# Altium project STM_controller.PrjPcb
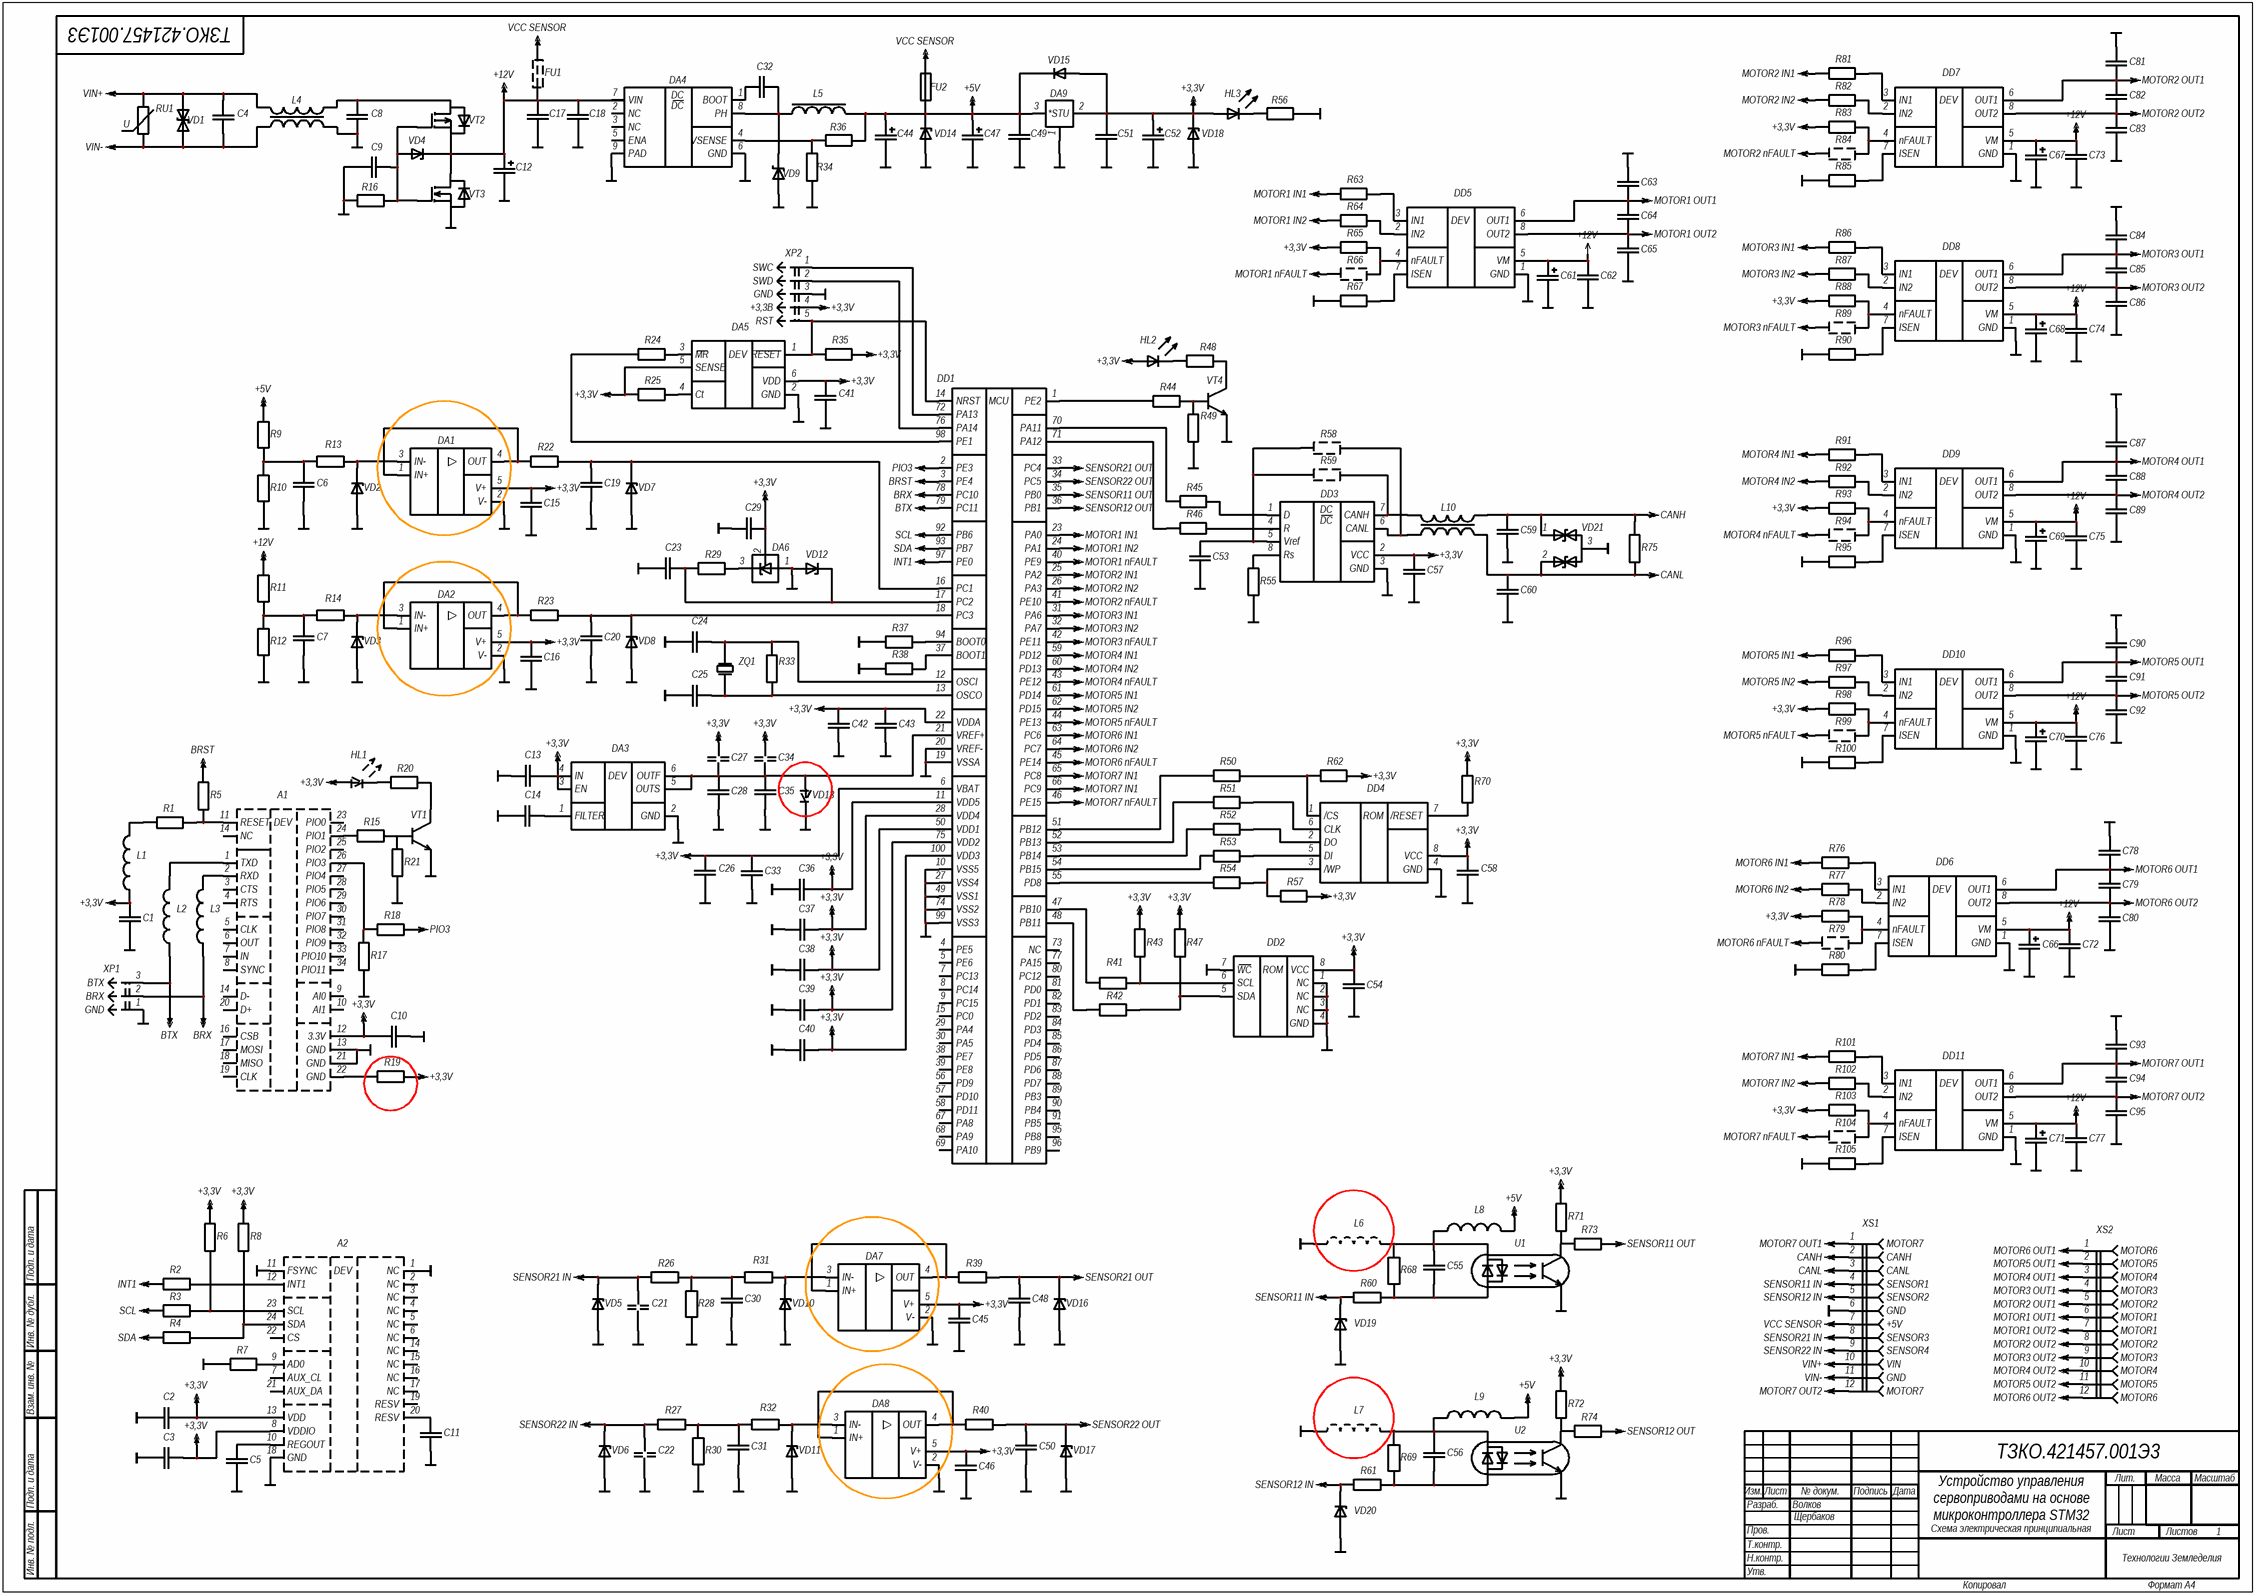
[diagram p0: Microcontroller.SchDoc]
1 sheet, 270 parts. Net scope: global (net labels, ports and power ports of the same name join across sheets).

## Sheet Microcontroller.SchDoc
size 840 x 594 mm; SheetNumber: 1; SheetTotal: 1; Разработчик: Волков; Количество_листов: 1; Организация: Технологии Земледелия; Номер_документа: ТЗКО.421457.001Э3; Название_документа: Устройство управления сервоприводами на основе микроконтроллера STM32

### Parts
A1  HC-06  (value not drawn)
A2  ICM-20948  (value not drawn)
C1  Capacitor_Fixed  (value not drawn)
C2  Capacitor_Fixed  (value not drawn)
C3  Capacitor_Fixed  (value not drawn)
C4  Capacitor_Fixed  (value not drawn)
C5  Capacitor_Fixed  (value not drawn)
C6  Capacitor_Fixed  (value not drawn)
C7  Capacitor_Fixed  (value not drawn)
C8  Capacitor_Fixed  (value not drawn)
C9  Capacitor_Fixed  (value not drawn)
C10  Capacitor_Fixed  (value not drawn)
C11  Capacitor_Fixed  (value not drawn)
C12  Capacitor_Polarized  (value not drawn)
C13  Capacitor_Fixed  (value not drawn)
C14  Capacitor_Fixed  (value not drawn)
C15  Capacitor_Fixed  (value not drawn)
C16  Capacitor_Fixed  (value not drawn)
C17  Capacitor_Fixed  (value not drawn)
C18  Capacitor_Fixed  (value not drawn)
C19  Capacitor_Fixed  (value not drawn)
C20  Capacitor_Fixed  (value not drawn)
C21  Capacitor_Fixed_Not_Installed  (value not drawn)
C22  Capacitor_Fixed_Not_Installed  (value not drawn)
C23  Capacitor_Fixed  (value not drawn)
C24  Capacitor_Fixed  (value not drawn)
C25  Capacitor_Fixed  (value not drawn)
C26  Capacitor_Fixed  (value not drawn)
C27  Capacitor_Fixed_Not_Installed  (value not drawn)
C28  Capacitor_Fixed  (value not drawn)
C29  Capacitor_Fixed  (value not drawn)
C30  Capacitor_Fixed  (value not drawn)
C31  Capacitor_Fixed  (value not drawn)
C32  Capacitor_Fixed  (value not drawn)
C33  Capacitor_Fixed  (value not drawn)
C34  Capacitor_Fixed_Not_Installed  (value not drawn)
C35  Capacitor_Fixed  (value not drawn)
C36  Capacitor_Fixed  (value not drawn)
C37  Capacitor_Fixed  (value not drawn)
C38  Capacitor_Fixed  (value not drawn)
C39  Capacitor_Fixed  (value not drawn)
C40  Capacitor_Fixed  (value not drawn)
C41  Capacitor_Fixed  (value not drawn)
C42  Capacitor_Fixed  (value not drawn)
C43  Capacitor_Fixed  (value not drawn)
C44  Capacitor_Polarized  (value not drawn)
C45  Capacitor_Fixed  (value not drawn)
C46  Capacitor_Fixed  (value not drawn)
C47  Capacitor_Polarized  (value not drawn)
C48  Capacitor_Fixed  (value not drawn)
C49  Capacitor_Fixed  (value not drawn)
C50  Capacitor_Fixed  (value not drawn)
C51  Capacitor_Fixed  (value not drawn)
C52  Capacitor_Polarized  (value not drawn)
C53  Capacitor_Fixed  (value not drawn)
C54  Capacitor_Fixed  (value not drawn)
C55  Capacitor_Fixed  (value not drawn)
C56  Capacitor_Fixed  (value not drawn)
C57  Capacitor_Fixed  (value not drawn)
C58  Capacitor_Fixed  (value not drawn)
C59  Capacitor_Fixed  (value not drawn)
C60  Capacitor_Fixed  (value not drawn)
C61  Capacitor_Polarized  (value not drawn)
C62  Capacitor_Fixed  (value not drawn)
C63  Capacitor_Fixed  (value not drawn)
C64  Capacitor_Fixed  (value not drawn)
C65  Capacitor_Fixed  (value not drawn)
C66  Capacitor_Polarized  (value not drawn)
C67  Capacitor_Polarized  (value not drawn)
C68  Capacitor_Polarized  (value not drawn)
C69  Capacitor_Polarized  (value not drawn)
C70  Capacitor_Polarized  (value not drawn)
C71  Capacitor_Polarized  (value not drawn)
C72  Capacitor_Fixed  (value not drawn)
C73  Capacitor_Fixed  (value not drawn)
C74  Capacitor_Fixed  (value not drawn)
C75  Capacitor_Fixed  (value not drawn)
C76  Capacitor_Fixed  (value not drawn)
C77  Capacitor_Fixed  (value not drawn)
C78  Capacitor_Fixed  (value not drawn)
C79  Capacitor_Fixed  (value not drawn)
C80  Capacitor_Fixed  (value not drawn)
C81  Capacitor_Fixed  (value not drawn)
C82  Capacitor_Fixed  (value not drawn)
C83  Capacitor_Fixed  (value not drawn)
C84  Capacitor_Fixed  (value not drawn)
C85  Capacitor_Fixed  (value not drawn)
C86  Capacitor_Fixed  (value not drawn)
C87  Capacitor_Fixed  (value not drawn)
C88  Capacitor_Fixed  (value not drawn)
C89  Capacitor_Fixed  (value not drawn)
C90  Capacitor_Fixed  (value not drawn)
C91  Capacitor_Fixed  (value not drawn)
C92  Capacitor_Fixed  (value not drawn)
C93  Capacitor_Fixed  (value not drawn)
C94  Capacitor_Fixed  (value not drawn)
C95  Capacitor_Fixed  (value not drawn)
DA1  OPA348AIDBVR  (value not drawn)
DA2  OPA348AIDBVR  (value not drawn)
DA3  MAX6070BAUT12+T  (value not drawn)
DA4  TPS5430DDAR  (value not drawn)
DA5  TPS3808G33DBVR  (value not drawn)
DA6  TL431  (value not drawn)
DA7  OPA348AIDBVR  (value not drawn)
DA8  OPA348AIDBVR  (value not drawn)
DA9  LM1117MP  (value not drawn)
DD1  STM32F103VET6  (value not drawn)
DD2  M24256E-FMN6TP  (value not drawn)
DD3  VP230  (value not drawn)
DD4  W25Q64JVSSIQ  (value not drawn)
DD5  AT8236  (value not drawn)
DD6  AT8236  (value not drawn)
DD7  AT8236  (value not drawn)
DD8  AT8236  (value not drawn)
DD9  AT8236  (value not drawn)
DD10  AT8236  (value not drawn)
DD11  AT8236  (value not drawn)
FU1  Fuse_Not_Inctalled  (value not drawn)
FU2  Fuse  (value not drawn)
HL1  Diode_Light_Emitting_Not_Installed  (value not drawn)
HL2  Diode_Light_Emitting  (value not drawn)
HL3  Diode_Light_Emitting  (value not drawn)
L1  Inductor  (value not drawn)
L2  Inductor  (value not drawn)
L3  Inductor  (value not drawn)
L4  Inductor_Cored_Double  (value not drawn)
L5  Inductor_Cored  (value not drawn)
L6  Inductor_Not_Installed  (value not drawn)
L7  Inductor_Not_Installed  (value not drawn)
L8  Inductor  (value not drawn)
L9  Inductor  (value not drawn)
L10  Inductor_Cored_Double  (value not drawn)
R1  Resistor_Fixed  (value not drawn)
R2  Resistor_Fixed  (value not drawn)
R3  Resistor_Fixed  (value not drawn)
R4  Resistor_Fixed  (value not drawn)
R5  Resistor_Fixed  (value not drawn)
R6  Resistor_Fixed  (value not drawn)
R7  Resistor_Fixed  (value not drawn)
R8  Resistor_Fixed  (value not drawn)
R9  Resistor_Fixed  (value not drawn)
R10  Resistor_Fixed  (value not drawn)
R11  Resistor_Fixed  (value not drawn)
R12  Resistor_Fixed  (value not drawn)
R13  Resistor_Fixed  (value not drawn)
R14  Resistor_Fixed  (value not drawn)
R15  Resistor_Fixed  (value not drawn)
R16  Resistor_Fixed  (value not drawn)
R17  Resistor_Fixed  (value not drawn)
R18  Resistor_Fixed  (value not drawn)
R19  Resistor_Fixed  (value not drawn)
R20  Resistor_Fixed  (value not drawn)
R21  Resistor_Fixed  (value not drawn)
R22  Resistor_Fixed  (value not drawn)
R23  Resistor_Fixed  (value not drawn)
R24  Resistor_Fixed  (value not drawn)
R25  Resistor_Fixed  (value not drawn)
R26  Resistor_Fixed  (value not drawn)
R27  Resistor_Fixed  (value not drawn)
R28  Resistor_Fixed  (value not drawn)
R29  Resistor_Fixed  (value not drawn)
R30  Resistor_Fixed  (value not drawn)
R31  Resistor_Fixed  (value not drawn)
R32  Resistor_Fixed  (value not drawn)
R33  Resistor_Fixed  (value not drawn)
R34  Resistor_Fixed  (value not drawn)
R35  Resistor_Fixed  (value not drawn)
R36  Resistor_Fixed  (value not drawn)
R37  Resistor_Fixed  (value not drawn)
R38  Resistor_Fixed  (value not drawn)
R39  Resistor_Fixed  (value not drawn)
R40  Resistor_Fixed  (value not drawn)
R41  Resistor_Fixed  (value not drawn)
R42  Resistor_Fixed  (value not drawn)
R43  Resistor_Fixed  (value not drawn)
R44  Resistor_Fixed  (value not drawn)
R45  Resistor_Fixed  (value not drawn)
R46  Resistor_Fixed  (value not drawn)
R47  Resistor_Fixed  (value not drawn)
R48  Resistor_Fixed  (value not drawn)
R49  Resistor_Fixed  (value not drawn)
R50  Resistor_Fixed  (value not drawn)
R51  Resistor_Fixed  (value not drawn)
R52  Resistor_Fixed  (value not drawn)
R53  Resistor_Fixed  (value not drawn)
R54  Resistor_Fixed  (value not drawn)
R55  Resistor_Fixed  (value not drawn)
R56  Resistor_Fixed  (value not drawn)
R57  Resistor_Fixed  (value not drawn)
R58  Resistor_Fixed_Not_Installed  (value not drawn)
R59  Resistor_Fixed_Not_Installed  (value not drawn)
R60  Resistor_Fixed  (value not drawn)
R61  Resistor_Fixed  (value not drawn)
R62  Resistor_Fixed  (value not drawn)
R63  Resistor_Fixed  (value not drawn)
R64  Resistor_Fixed  (value not drawn)
R65  Resistor_Fixed  (value not drawn)
R66  Resistor_Fixed_Not_Installed  (value not drawn)
R67  Resistor_Fixed  (value not drawn)
R68  Resistor_Fixed  (value not drawn)
R69  Resistor_Fixed  (value not drawn)
R70  Resistor_Fixed  (value not drawn)
R71  Resistor_Fixed  (value not drawn)
R72  Resistor_Fixed  (value not drawn)
R73  Resistor_Fixed  (value not drawn)
R74  Resistor_Fixed  (value not drawn)
R75  Resistor_Fixed  (value not drawn)
R76  Resistor_Fixed  (value not drawn)
R77  Resistor_Fixed  (value not drawn)
R78  Resistor_Fixed  (value not drawn)
R79  Resistor_Fixed_Not_Installed  (value not drawn)
R80  Resistor_Fixed  (value not drawn)
R81  Resistor_Fixed  (value not drawn)
R82  Resistor_Fixed  (value not drawn)
R83  Resistor_Fixed  (value not drawn)
R84  Resistor_Fixed_Not_Installed  (value not drawn)
R85  Resistor_Fixed  (value not drawn)
R86  Resistor_Fixed  (value not drawn)
R87  Resistor_Fixed  (value not drawn)
R88  Resistor_Fixed  (value not drawn)
R89  Resistor_Fixed_Not_Installed  (value not drawn)
R90  Resistor_Fixed  (value not drawn)
R91  Resistor_Fixed  (value not drawn)
R92  Resistor_Fixed  (value not drawn)
R93  Resistor_Fixed  (value not drawn)
R94  Resistor_Fixed_Not_Installed  (value not drawn)
R95  Resistor_Fixed  (value not drawn)
R96  Resistor_Fixed  (value not drawn)
R97  Resistor_Fixed  (value not drawn)
R98  Resistor_Fixed  (value not drawn)
R99  Resistor_Fixed_Not_Installed  (value not drawn)
R100  Resistor_Fixed  (value not drawn)
R101  Resistor_Fixed  (value not drawn)
R102  Resistor_Fixed  (value not drawn)
R103  Resistor_Fixed  (value not drawn)
R104  Resistor_Fixed_Not_Installed  (value not drawn)
R105  Resistor_Fixed  (value not drawn)
RU1  Resistor_Varistor  (value not drawn)
U1  EL3H4  (value not drawn)
U2  EL3H4  (value not drawn)
VD1  5.0SMDJ36CA  (value not drawn)
VD2  Diode_Zener  (value not drawn)
VD3  Diode_Zener  (value not drawn)
VD4  Diode_Zener  (value not drawn)
VD5  Diode_Zener  (value not drawn)
VD6  Diode_Zener  (value not drawn)
VD7  Diode_Zener  (value not drawn)
VD8  Diode_Zener  (value not drawn)
VD9  Diode_Schottky  (value not drawn)
VD10  Diode_Zener  (value not drawn)
VD11  Diode_Zener  (value not drawn)
VD12  Diode_Zener  (value not drawn)
VD13  Diode_Junction_Not_Installed  (value not drawn)
VD14  Diode_Zener  (value not drawn)
VD15  Diode_Junction  (value not drawn)
VD16  Diode_Zener  (value not drawn)
VD17  Diode_Zener  (value not drawn)
VD18  Diode_Zener  (value not drawn)
VD19  Diode_Zener  (value not drawn)
VD20  Diode_Zener  (value not drawn)
VD21  SM24CANB-02HTG  (value not drawn)
VT1  BC817  (value not drawn)
VT2  STD35P6LLF6  (value not drawn)
VT3  FDB7030BL  (value not drawn)
VT4  BC817  (value not drawn)
XP1  Connector_Bluetooth_Not_Installed  (value not drawn)
XP2  Connector_STLink_Not_Installed  (value not drawn)
XS1  Connector_Left  (value not drawn)
XS2  Connector_Right  (value not drawn)
ZQ1  Quartz_Resonator  (value not drawn)

### Nets
+3,3V: A1.12(3.3V) A2.8(VDDIO) A2.13(VDD) C1.2 C2.2 C3.2 C10.1 C13.1 C15.2 C16.2 C26.2 C27.1 C29.1 C33.1 C34.1 C36.2 C37.1 C38.1 C39.1 C40.1 C41.2 C42.1 C43.1 C45.2 C46.2 C51.2 C52.1(Anode) C54.2 C57.2 C58.2 DA1.5(V+) DA2.5(V+) DA3.3(EN) DA3.4(IN) DA5.5(SENSE) DA5.6(VDD) DA6.2(Reference) DA7.5(V+) DA8.5(V+) DA9.2(VOUT) DD1.6(VBAT) DD1.11(VDD5) DD1.22(VDDA) DD1.28(VDD4) DD1.50(VDD1) DD1.75(VDD2) DD1.100(VDD3) DD2.8(VCC) DD3.2(VCC) DD4.8(VCC) HL1.1(Anode) HL2.1(Anode) HL3.1(Anode) L1.1 R6.2 R8.2 R19.1 R25.2 R35.2 R43.2 R47.2 R57.2 R62.2 R65.1 R70.2 R71.1 R72.1 R78.1 R83.1 R88.1 R93.1 R98.1 R103.1 VD15.1(Anode) VD18.2(Cathode) XP2.4(+3,3В)
+5V: C44.1(Anode) C47.1(Anode) C49.2 DA9.3(VIN) FU2.1 L5.2 L8.2 L9.2 R9.1 R36.2 VD14.2(Cathode) VD15.2(Cathode)
+12V: C12.1(Anode) C17.2 C18.2 C61.1(Anode) C62.2 C66.1(Anode) C67.1(Anode) C68.1(Anode) C69.1(Anode) C70.1(Anode) C71.1(Anode) C72.2 C73.2 C74.2 C75.2 C76.2 C77.2 DA4.7(VIN) DD5.5(VM) DD6.5(VM) DD7.5(VM) DD8.5(VM) DD9.5(VM) DD10.5(VM) DD11.5(VM) FU1.1 R11.1 VD4.2(Cathode) VT2.2(Source) VT3.3(Drain)
BRST: DD1.3(PE4) R5.2
BRX: DD1.78(PC10) L3.1 XP1.2(BRX)
BTX: DD1.79(PC11) L2.1 XP1.3(BTX)
CANH: C59.1 L10.4 R75.2 VD21.1(CANH) XS1.2(CANH)
CANL: C60.2 L10.3 R75.1 VD21.2(CANL) XS1.3(CANL)
GND: A1.13(GND) A1.21(GND) A2.1(NC) A2.11(FSYNC) A2.18(GND) C1.1 C2.1 C3.1 C5.1 C6.1 C7.1 C8.1 C9.1 C10.2 C11.2 C12.2(Cathode) C13.2 C14.1 C15.1 C16.1 C17.1 C18.1 C19.1 C20.1 C21.1 C22.1 C23.1 C24.1 C25.1 C26.1 C28.1 C29.2 C30.1 C31.1 C33.2 C35.1 C36.1 C37.2 C38.2 C39.2 C40.2 C41.1 C42.2 C43.2 C44.2(Cathode) C45.1 C46.1 C47.2(Cathode) C48.1 C49.1 C50.1 C51.1 C52.2(Cathode) C53.1 C54.1 C57.1 C58.1 C59.2 C60.1 C61.2(Cathode) C62.1 C63.2 C65.1 C66.2(Cathode) C67.2(Cathode) C68.2(Cathode) C69.2(Cathode) C70.2(Cathode) C71.2(Cathode) C72.1 C73.1 C74.1 C75.1 C76.1 C77.1 C78.2 C80.1 C81.2 C83.1 C84.2 C86.1 C87.2 C89.1 C90.2 C92.1 C93.2 C95.1 DA1.2(V-) DA2.2(V-) DA3.2(GND) DA4.6(GND) DA4.9(PAD) DA5.2(GND) DA6.1(Cathode) DA7.2(V-) DA8.2(V-) DA9.1(GND) DD1.10(VSS5) DD1.19(VSSA) DD1.20(VREF-) DD1.27(VSS4) DD1.49(VSS1) DD1.74(VSS2) DD1.99(VSS3) DD2.1(NC) DD2.2(NC) DD2.3(NC) DD2.4(GND) DD2.7(WC) DD3.3(GND) DD4.4(GND) DD5.1(GND) DD6.1(GND) DD7.1(GND) DD8.1(GND) DD9.1(GND) DD10.1(GND) DD11.1(GND) L4.3 L6.1 R7.1 R10.2 R12.2 R16.1 R17.1 R21.1 R28.2 R30.2 R34.1 R37.1 R38.1 R49.1 R55.1 R56.2 R67.1 R80.1 R85.1 R90.1 R95.1 R100.1 R105.1 U1.3 U2.3 VD2.1(Anode) VD3.1(Anode) VD5.1(Anode) VD6.1(Anode) VD7.1(Anode) VD8.1(Anode) VD9.1(Anode) VD10.1(Anode) VD11.1(Anode) VD12.1(Anode) VD13.2(Cathode) VD14.1(Anode) VD16.1(Anode) VD17.1(Anode) VD18.1(Anode) VD19.1(Anode) VD20.1(Anode) VD21.3(COM) VT1.2(Emitter) VT3.2(Source) VT4.2(Emitter) XP1.1(GND) XP2.3(GND) XS1.6(GND)
INT1: DD1.97(PE0) R2.1
MOTOR1 IN1: DD1.23(PA0) R63.1
MOTOR1 IN2: DD1.24(PA1) R64.1
MOTOR1 nFAULT: DD1.40(PE9) R66.1
MOTOR1 OUT1: C63.1 C64.2 DD5.6(OUT1) XS2.6(MOTOR1)
MOTOR1 OUT2: C64.1 C65.2 DD5.8(OUT2) XS2.7(MOTOR1)
MOTOR2 IN1: DD1.25(PA2) R81.1
MOTOR2 IN2: DD1.26(PA3) R82.1
MOTOR2 nFAULT: DD1.41(PE10) R84.1
MOTOR2 OUT1: C81.1 C82.2 DD7.6(OUT1) XS2.5(MOTOR2)
MOTOR2 OUT2: C82.1 C83.2 DD7.8(OUT2) XS2.8(MOTOR2)
MOTOR3 IN1: DD1.31(PA6) R86.1
MOTOR3 IN2: DD1.32(PA7) R87.1
MOTOR3 nFAULT: DD1.42(PE11) R89.1
MOTOR3 OUT1: C84.1 C85.2 DD8.6(OUT1) XS2.4(MOTOR3)
MOTOR3 OUT2: C85.1 C86.2 DD8.8(OUT2) XS2.9(MOTOR3)
MOTOR4 IN1: DD1.59(PD12) R91.1
MOTOR4 IN2: DD1.60(PD13) R92.1
MOTOR4 nFAULT: DD1.43(PE12) R94.1
MOTOR4 OUT1: C87.1 C88.2 DD9.6(OUT1) XS2.3(MOTOR4)
MOTOR4 OUT2: C88.1 C89.2 DD9.8(OUT2) XS2.10(MOTOR4)
MOTOR5 IN1: DD1.61(PD14) R96.1
MOTOR5 IN2: DD1.62(PD15) R97.1
MOTOR5 nFAULT: DD1.44(PE13) R99.1
MOTOR5 OUT1: C90.1 C91.2 DD10.6(OUT1) XS2.2(MOTOR5)
MOTOR5 OUT2: C91.1 C92.2 DD10.8(OUT2) XS2.11(MOTOR5)
MOTOR6 IN1: DD1.63(PC6) R76.1
MOTOR6 IN2: DD1.64(PC7) R77.1
MOTOR6 nFAULT: DD1.45(PE14) R79.1
MOTOR6 OUT1: C78.1 C79.2 DD6.6(OUT1) XS2.1(MOTOR6)
MOTOR6 OUT2: C79.1 C80.2 DD6.8(OUT2) XS2.12(MOTOR6)
MOTOR7 IN1: DD1.65(PC8) DD1.66(PC9) R101.1
MOTOR7 IN2: R102.1
MOTOR7 nFAULT: DD1.46(PE15) R104.1
MOTOR7 OUT1: C93.1 C94.2 DD11.6(OUT1) XS1.1(MOTOR7)
MOTOR7 OUT2: C94.1 C95.2 DD11.8(OUT2) XS1.12(MOTOR7)
PIO3: DD1.2(PE3) R18.1
SCL: DD1.92(PB6) R3.1
SDA: DD1.93(PB7) R4.1
SENSOR11 IN: R60.2 VD19.2(Cathode) XS1.4(SENSOR1)
SENSOR11 OUT: DD1.35(PB0) R73.2
SENSOR12 IN: R61.2 VD20.2(Cathode) XS1.5(SENSOR2)
SENSOR12 OUT: DD1.36(PB1) R74.2
SENSOR21 IN: C21.2 R26.1 VD5.2(Cathode) XS1.8(SENSOR3)
SENSOR21 OUT: C48.2 DD1.33(PC4) R39.2 VD16.2(Cathode)
SENSOR22 IN: C22.2 R27.1 VD6.2(Cathode) XS1.9(SENSOR4)
SENSOR22 OUT: C50.2 DD1.34(PC5) R40.2 VD17.2(Cathode)
VCC SENSOR: FU1.2 FU2.2 XS1.7(+5V)
VIN+: C4.1 L4.1 RU1.1 VD1.2 XS1.10(VIN)
VIN-: C4.2 L4.2 RU1.2 VD1.1 XS1.11(GND)
NetA1_1: A1.1(TXD) L2.2
NetA1_2: A1.2(RXD) L3.2
NetA1_11: A1.11(RESET) R1.2 R5.1
NetA1_22: A1.22(GND) R19.2
NetA1_24: A1.24(PIO1) R15.2
NetA1_26: A1.26(PIO3) R17.2 R18.2
NetA2_9: A2.9(AD0) R7.2
NetA2_10: A2.10(REGOUT) C5.2
NetA2_12: A2.12(INT1) R2.2
NetA2_20: A2.20(RESV) C11.1
NetA2_23: A2.23(SCL) R3.2 R6.1
NetA2_24: A2.24(SDA) R4.2 R8.1
NetC6_2: C6.2 R9.2 R10.1 R13.1
NetC7_2: C7.2 R11.2 R12.1 R14.1
NetC8_2: C8.2 L4.4 VT2.3(Drain)
NetC9_2: C9.2 R16.2 VD4.1(Anode) VT2.1(Gate) VT3.1(Gate)
NetC14_2: C14.2 DA3.1(FILTER)
NetC19_2: C19.2 DD1.16(PC1) R22.2 VD7.2(Cathode)
NetC20_2: C20.2 DD1.18(PC3) R23.2 VD8.2(Cathode)
NetC23_2: C23.2 DD1.17(PC2) R29.2 VD12.2(Cathode)
NetC24_2: C24.2 DD1.12(OSCI) R33.2 ZQ1.5(Anode)
NetC25_2: C25.2 DD1.13(OSCO) R33.1 ZQ1.4(Anode)
NetC27_2: C27.2 C28.2 C34.2 C35.2 DA3.5(OUTS) DA3.6(OUTF) DD1.21(VREF+) VD13.1(Anode)
NetC30_2: C30.2 R26.2 R28.1 R31.1
NetC31_2: C31.2 R27.2 R30.1 R32.1
NetC32_1: C32.1 DA4.1(BOOT)
NetC32_2: C32.2 DA4.8(PH) L5.1 VD9.2(Cathode)
NetC53_2: C53.2 DD3.5(Vref) R58.1 R59.1
NetC55_1: C55.1 R60.1 R68.1 U1.2
NetC55_2: C55.2 L6.2 L8.1 R68.2 U1.1
NetC56_1: C56.1 R61.1 R69.1 U2.2
NetC56_2: C56.2 L7.2 L9.1 R69.2 U2.1
NetDA1_1: DA1.1(IN+) DA1.4(OUT) R22.1
NetDA1_3: DA1.3(IN-) R13.2 VD2.2(Cathode)
NetDA2_1: DA2.1(IN+) DA2.4(OUT) R23.1
NetDA2_3: DA2.3(IN-) R14.2 VD3.2(Cathode)
NetDA4_4: DA4.4(VSENSE) R34.2 R36.1
NetDA5_1: DA5.1(RESET) DD1.14(NRST) R35.1 XP2.5(RST)
NetDA5_3: DA5.3(MR) R24.2
NetDA5_4: DA5.4(Ct) R25.1
NetDA6_3: DA6.3(Anode) R29.1
NetDA7_1: DA7.1(IN+) DA7.4(OUT) R39.1
NetDA7_3: DA7.3(IN-) R31.2 VD10.2(Cathode)
NetDA8_1: DA8.1(IN+) DA8.4(OUT) R40.1
NetDA8_3: DA8.3(IN-) R32.2 VD11.2(Cathode)
NetDD1_1: DD1.1(PE2) R44.2
NetDD1_37: DD1.37(BOOT1) R38.2
NetDD1_47: DD1.47(PB10) R41.1
NetDD1_48: DD1.48(PB11) R42.1
NetDD1_51: DD1.51(PB12) R50.1
NetDD1_52: DD1.52(PB13) R51.1
NetDD1_53: DD1.53(PB14) R52.1
NetDD1_54: DD1.54(PB15) R53.1
NetDD1_55: DD1.55(PD8) R54.1
NetDD1_70: DD1.70(PA11) R45.1
NetDD1_71: DD1.71(PA12) R46.1
NetDD1_72: DD1.72(PA13) XP2.1(SWC)
NetDD1_76: DD1.76(PA14) XP2.2(SWD)
NetDD1_94: DD1.94(BOOT0) R37.2
NetDD1_98: DD1.98(PE1) R24.1
NetDD2_5: DD2.5(SDA) R42.2 R47.1
NetDD2_6: DD2.6(SCL) R41.2 R43.1
NetDD3_1: DD3.1(D) R45.2
NetDD3_4: DD3.4(R) R46.2
NetDD3_6: DD3.6(CANL) L10.2 R58.2
NetDD3_7: DD3.7(CANH) L10.1 R59.2
NetDD3_8: DD3.8(Rs) R55.2
NetDD4_1: DD4.1(/CS) R50.2 R62.1
NetDD4_2: DD4.2(DO) R52.2
NetDD4_3: DD4.3(/WP) R54.2 R57.1
NetDD4_5: DD4.5(DI) R53.2
NetDD4_6: DD4.6(CLK) R51.2
NetDD4_7: DD4.7(/RESET) R70.1
NetDD5_2: DD5.2(IN2) R64.2
NetDD5_3: DD5.3(IN1) R63.2
NetDD5_4: DD5.4(nFAULT) R65.2 R66.2
NetDD5_7: DD5.7(ISEN) R67.2
NetDD6_2: DD6.2(IN2) R77.2
NetDD6_3: DD6.3(IN1) R76.2
NetDD6_4: DD6.4(nFAULT) R78.2 R79.2
NetDD6_7: DD6.7(ISEN) R80.2
NetDD7_2: DD7.2(IN2) R82.2
NetDD7_3: DD7.3(IN1) R81.2
NetDD7_4: DD7.4(nFAULT) R83.2 R84.2
NetDD7_7: DD7.7(ISEN) R85.2
NetDD8_2: DD8.2(IN2) R87.2
NetDD8_3: DD8.3(IN1) R86.2
NetDD8_4: DD8.4(nFAULT) R88.2 R89.2
NetDD8_7: DD8.7(ISEN) R90.2
NetDD9_2: DD9.2(IN2) R92.2
NetDD9_3: DD9.3(IN1) R91.2
NetDD9_4: DD9.4(nFAULT) R93.2 R94.2
NetDD9_7: DD9.7(ISEN) R95.2
NetDD10_2: DD10.2(IN2) R97.2
NetDD10_3: DD10.3(IN1) R96.2
NetDD10_4: DD10.4(nFAULT) R98.2 R99.2
NetDD10_7: DD10.7(ISEN) R100.2
NetDD11_2: DD11.2(IN2) R102.2
NetDD11_3: DD11.3(IN1) R101.2
NetDD11_4: DD11.4(nFAULT) R103.2 R104.2
NetDD11_7: DD11.7(ISEN) R105.2
NetHL1_2: HL1.2(Cathode) R20.2
NetHL2_2: HL2.2(Cathode) R48.1
NetHL3_2: HL3.2(Cathode) R56.1
NetL1_2: L1.2 R1.1
NetR15_1: R15.1 R21.2 VT1.1(Base)
NetR20_1: R20.1 VT1.3(Collector)
NetR44_1: R44.1 R49.2 VT4.1(Base)
NetR48_2: R48.2 VT4.3(Collector)
NetR71_2: R71.2 R73.1 U1.4
NetR72_2: R72.2 R74.1 U2.4

Not connected (* = marked no-connect by the designer): A1 3(CTS) 4(RTS) 5(CLK) 6(OUT) 7(IN) 8(SYNC) 9(AI0) 10(AI1) 14(NC) 16(CSB) 17(MOSI) 18(MISO) 19(CLK) 20(D+) 23(PIO0) 25(PIO2) 27(PIO4) 28(PIO5) 29(PIO6) 30(PIO7) 31(PIO8) 32(PIO9) 33(PIO10) 34(PIO11); A2 2(NC) 3(NC) 4(NC) 5(NC) 6(NC) 7(AUX_CL) 14(NC) 15(NC) 16(NC) 17(NC) 19(RESV) 21(AUX_DA) 22(CS); DA4 2(NC) 3(NC) 5(ENA); DD1 4(PE5) 5(PE6) 7(PC13) 8(PC14) 9(PC15) 15(PC0) 29(PA4) 30(PA5) 38(PE7) 39(PE8) 56(PD9) 57(PD10) 58(PD11) 67(PA8) 68(PA9) 69(PA10) 73(NC) 77(PA15) 80(PC12) 81(PD0) 82(PD1) 83(PD2) 84(PD3) 85(PD4) 86(PD5) 87(PD6) 88(PD7) 89(PB3) 90(PB4) 91(PB5) 95(PB8) 96(PB9); L7 1

### Notes on the sheet
- Подп. и дата
- Инв. № дубл.
- Взам. инв. №
- Разраб.
- Изм.
- Лист
- № докум.
- Подпись
- Дата
- Лит.
- Масса
- Масштаб
- Пров.
- Щербаков
- Схема электрическая принципиальная
- Листов
- Н.контр.
- Утв.
- Т.контр.
- Инв. № подл.
- Копировал
- Формат А4
- (in symbol Device_Bluetooth_HC-06_Not_Installed) DEV
- (in symbol Device_Gyroscope_Accelerometer_ICM-20948_Not_Installed) DEV
- (in symbol Microcircuit_Analog_DC_DC_Converter_TPS5430) DC
- (in symbol Microcircuit_Analog_Linear_Stabilizer_LM1117MP) *STU
- (in symbol Microcircuit_Analog_Power_Monitor_TPS3808G33DBVR) DEV
- (in symbol Microcircuit_Analog_Reference_Voltage_Source_MAX6070BAUT12+T) DEV
- (in symbol Microcircuit_Digital_Memory_EEPROM_M24256E-FMN6TP) ROM
- (in symbol Microcircuit_Digital_Memory_Flash_W25Q64JVSSIQ) ROM
- (in symbol Microcircuit_Digital_Microcontroller_STM32VET6) MCU
- (in symbol Microcircuit_Digital_Motor_Driver_AT8236) DEV
- (in symbol Microcircuit_Digital_Transceiver_UART_CAN) DC
- (in symbol Resistor_Varistor) U

### Library data of the parts
A1 = Device_Bluetooth_HC-06_Not_Installed: 34 pin 3,3V not installed; ComponentLink1Description: chipdip; ComponentLink1URL: https://www.chipdip.ru/product/hc-06; ComponentLink2Description: datasheet; ComponentLink2URL: https://static.chipdip.ru/lib/734/DOC021734960.pdf; ComponentLink3Description: elecbee; ComponentLink3URL: https://www.elecbee.com/en-24700-RS232-TTL-HC-06-Wireless-bluetooth-RF-Transceiver-Serial-Module
A2 = Device_Gyroscope_Accelerometer_ICM-20948_Not_Installed: 24 pin 3,3V not installed; ComponentLink1Description: chipdip; ComponentLink1URL: https://www.chipdip.ru/product0/8025239061; ComponentLink2Description: datasheet; ComponentLink2URL: https://static.chipdip.ru/lib/718/DOC011718862.pdf
C1-C11 C13-C20 C23-C26 C28-C33 C35-C43 C45 C46 C48-C51 C53-C60 C62-C65 C72-C95 = Capacitor_Fixed: 2 pin
C12 C44 C47 C52 C61 C66-C71 = Capacitor_Polarized: 2 pin
C21 C22 C27 C34 = Capacitor_Fixed_Not_Installed: 2 pin not installed
DA1 DA2 DA7 DA8 = Microcircuit_Analog_Operational_Amplifier_OPA348AIDBVR: 5 pin 3,3V; ComponentLink1Description: chipdip; ComponentLink1URL: https://www.chipdip.ru/product/opa348aidbvr-ti; ComponentLink2Description: datasheet; ComponentLink2URL: https://static.chipdip.ru/lib/923/DOC012923370.pdf
DA3 = Microcircuit_Analog_Reference_Voltage_Source_MAX6070BAUT12+T: 6 pin 3,3V; ComponentLink1Description: chipdip; ComponentLink1URL: https://www.chipdip.ru/product/max6070baut12-t; ComponentLink2Description: datasheet; ComponentLink2URL: https://static.chipdip.ru/lib/601/DOC028601577.pdf
DA4 = Microcircuit_Analog_DC_DC_Converter_TPS5430: 8 pin + pad from 12V to 5V; ComponentLink1Description: chipdip; ComponentLink1URL: https://www.chipdip.ru/product/tps5430ddar; ComponentLink2Description: datasheet; ComponentLink2URL: https://static.chipdip.ru/lib/666/DOC012666766.pdf
DA5 = Microcircuit_Analog_Power_Monitor_TPS3808G33DBVR: 6 pin 3,3V; ComponentLink1Description: chipdip; ComponentLink1URL: https://www.chipdip.ru/product0/8064500674; ComponentLink2Description: datasheet; ComponentLink2URL: *https://static.chipdip.ru/lib/928/DOC012928991.pdf
DA6 = Microcircuit_Analog_Reference_Power_Supply_TL431: 3 pin; ComponentLink1Description: chipdip; ComponentLink1URL: https://www.chipdip.by/product/tl431-sot-23; ComponentLink2Description: datasheet; ComponentLink2URL: https://static.chipdip.ru/lib/787/DOC021787563.pdf
DA9 = Microcircuit_Analog_Linear_Stabilizer_LM1117MP: 3 pin from 5V to 3,3V; ComponentLink1Description: chipdip; ComponentLink1URL: https://www.chipdip.ru/product/lm1117mp-3.3-nopb-sot223; ComponentLink2Description: datasheet; ComponentLink2URL: https://static.chipdip.ru/lib/028/DOC013028610.pdf
DD1 = Microcircuit_Digital_Microcontroller_STM32VET6: 100 pin 3,3V; ComponentLink1Description: chipdip; ComponentLink1URL: https://www.chipdip.ru/product0/8014323022; ComponentLink2Description: datasheet; ComponentLink2URL: https://static.chipdip.ru/lib/583/DOC001583197.pdf
DD2 = Microcircuit_Digital_Memory_EEPROM_M24256E-FMN6TP: 8 pin 3,3V; ComponentLink1Description: chipdip; ComponentLink1URL: https://www.chipdip.by/product0/8012153523; ComponentLink2Description: datasheet; ComponentLink2URL: https://static.chipdip.ru/lib/851/DOC040851462.pdf
DD3 = Microcircuit_Digital_Transceiver_UART_CAN: 8 pin 3,3V; ComponentLink1Description: chipdip; ComponentLink1URL: https://www.chipdip.ru/product/sn65hvd230d; ComponentLink2Description: datasheet; ComponentLink2URL: https://static.chipdip.ru/lib/204/DOC000204848.pdf
DD4 = Microcircuit_Digital_Memory_Flash_W25Q64JVSSIQ: 8 pin 3,3V; ComponentLink1Description: chipdip; ComponentLink1URL: https://www.chipdip.by/product/w25q64jvssiq; ComponentLink2Description: datasheet; ComponentLink2URL: https://static.chipdip.ru/lib/008/DOC013008214.pdf
DD5-DD11 = Microcircuit_Digital_Motor_Driver_AT8236: 8 pin 12V; ComponentLink1Description: chipdip; ComponentLink1URL: https://www.chipdip.by/product0/8015815062; ComponentLink2Description: datasheet; ComponentLink2URL: https://static.chipdip.ru/lib/795/DOC042795118.pdf
FU1 = Fuse_Not_Inctalled: 2 pin
FU2 = Fuse: 2 pin
HL1 = Diode_Light_Emitting_Not_Installed: 2 pin not installed
HL2 HL3 = Diode_Light_Emitting: 2 pin
L1-L3 L8 L9 = Inductor: 2 pin
L4 L10 = Inductor_Cored_Double: 4 pin
L5 = Inductor_Cored: 2 pin
L6 L7 = Inductor_Not_Installed: 2 pin not installed
R1-R57 R60-R65 R67-R78 R80-R83 R85-R88 R90-R93 R95-R98 R100-R103 R105 = Resistor_Fixed: 2 pin
R58 R59 R66 R79 R84 R89 R94 R99 R104 = Resistor_Fixed_Not_Installed: 2 pin not installed
RU1 = Resistor_Varistor: 2 pin
U1 U2 = Optocoupler_EL3H4: 4 pin; ComponentLink1Description: chipdip; ComponentLink1URL: https://www.chipdip.by/product0/8017599512; ComponentLink2Description: datasheet; ComponentLink2URL: https://static.chipdip.ru/lib/986/DOC012986431.pdf
VD1 = Diode_Suppressor_5.0SMDJ36CA: 2 pin; ComponentLink1Description: chipdip; ComponentLink1URL: https://www.chipdip.by/product0/8003261599; ComponentLink2Description: datasheet; ComponentLink2URL: https://static.chipdip.ru/lib/948/DOC005948039.pdf
VD2-VD8 VD10-VD12 VD14 VD16-VD20 = Diode_Zener: 2 pin
VD9 = Diode_Schottky: 2 pin
VD13 = Diode_Junction_Not_Installed: 2 pin
VD15 = Diode_Junction: 2 pin
VD21 = Diode_CAN_Array_Supressors_SM24CANB-02HTG: 3 pin; ComponentLink1Description: chipdip; ComponentLink1URL: https://www.chipdip.ru/product0/8002766404; ComponentLink2Description: datasheet; ComponentLink2URL: https://static.chipdip.ru/lib/251/DOC011251842.pdf
VT1 VT4 = Transistor_Bipolar_NPN_BC817: 3 pin; ComponentLink1Description: chipdip; ComponentLink1URL: https://www.chipdip.by/product/bc817-40; ComponentLink2Description: datasheet; ComponentLink2URL: https://static.chipdip.ru/lib/156/DOC000156781.pdf
VT2 = Transistor_Field_Effect_P_Induced_Channel_STD35P6LLF6: 3 pin; ComponentLink1Description: https://www.chipdip.by/product/std35p6llf6-umw; ComponentLink1URL: https://static.chipdip.ru/lib/207/DOC035207126.pdf; ComponentLink2Description: datasheet; ComponentLink2URL: https://static.chipdip.ru/lib/207/DOC035207126.pdf
VT3 = Transistor_Field_Effect_N_Induced_Channel_FDB7030BL: 3 pin; ComponentLink1Description: chipdip; ComponentLink1URL: https://www.chipdip.by/product/fdp7030bl-fairchild; ComponentLink2Description: datasheet; ComponentLink2URL: https://static.chipdip.ru/lib/304/DOC004304509.pdf
XP1 = Connector_Bluetooth_Not_Installed: 3 pin not installed
XP2 = Connector_STLink_Not_Installed: 5 pin not installed
XS1 = Connector_Left: 12 pin
XS2 = Connector_Right: 12 pin
ZQ1 = Quartz_Resonator: 2 pin